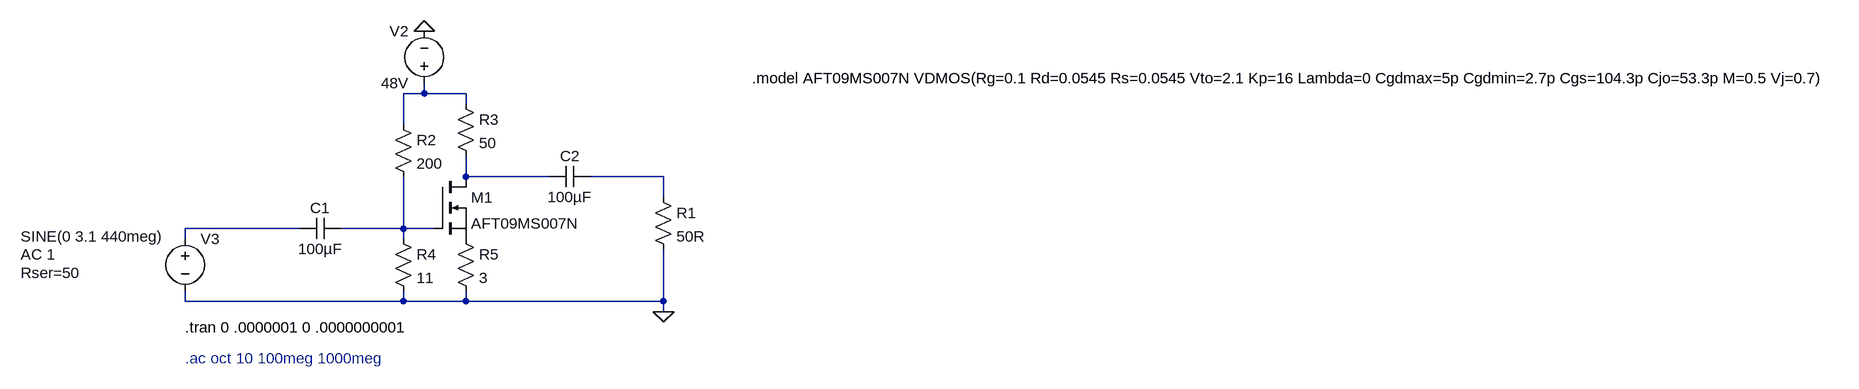
[diagram p0: schematic Draft1.asc]
Draft1.asc, the LTspice schematic file:
Version 4.1
SHEET 1 4972 680
WIRE 176 16 176 0
WIRE 176 16 144 16
WIRE 240 16 176 16
WIRE 240 32 240 16
WIRE 144 64 144 16
WIRE 240 144 240 112
WIRE 368 144 240 144
WIRE 544 144 432 144
WIRE 544 176 544 144
WIRE -16 224 -192 224
WIRE 144 224 144 144
WIRE 144 224 48 224
WIRE 192 224 144 224
WIRE -192 240 -192 224
WIRE 144 240 144 224
WIRE -192 336 -192 320
WIRE 144 336 144 320
WIRE 144 336 -192 336
WIRE 240 336 240 320
WIRE 240 336 144 336
WIRE 544 336 544 256
WIRE 544 336 240 336
WIRE 544 352 544 336
FLAG 544 352 0
FLAG 176 -80 0
SYMBOL nmos 192 144 R0
SYMATTR InstName M1
SYMATTR Value AFT09MS007N
SYMBOL voltage 176 16 R180
WINDOW 0 24 96 Left 2
WINDOW 3 24 16 Left 2
WINDOW 123 0 0 Left 0
WINDOW 39 0 0 Left 0
SYMATTR InstName V2
SYMATTR Value 48V
SYMBOL cap -16 208 M90
WINDOW 0 0 32 VBottom 2
WINDOW 3 32 32 VTop 2
SYMATTR InstName C1
SYMATTR Value 100µF
SYMBOL cap 368 160 R270
WINDOW 0 32 32 VTop 2
WINDOW 3 0 32 VBottom 2
SYMATTR InstName C2
SYMATTR Value 100µF
SYMBOL res 528 160 R0
SYMATTR InstName R1
SYMATTR Value 50R
SYMBOL voltage -192 224 R0
WINDOW 3 -253 12 Left 2
WINDOW 123 -253 40 Left 2
WINDOW 39 -253 68 Left 2
SYMATTR InstName V3
SYMATTR Value SINE(0 3.1 440meg)
SYMATTR Value2 AC 1
SYMATTR SpiceLine Rser=50
SYMBOL res 128 48 R0
SYMATTR InstName R2
SYMATTR Value 200
SYMBOL res 224 16 R0
SYMATTR InstName R3
SYMATTR Value 50
SYMBOL res 128 224 R0
SYMATTR InstName R4
SYMATTR Value 11
SYMBOL res 224 224 R0
SYMATTR InstName R5
SYMATTR Value 3
TEXT -192 376 Left 2 !.tran 0 .0000001 0 .0000000001
TEXT 680 -8 Left 2 !.model AFT09MS007N VDMOS(Rg=0.1 Rd=0.0545 Rs=0.0545 Vto=2.1 Kp=16 Lambda=0 Cgdmax=5p Cgdmin=2.7p Cgs=104.3p Cjo=53.3p M=0.5 Vj=0.7)
TEXT -192 424 Left 2 ;.ac oct 10 100meg 1000meg

The netlist it stands for:
* Draft1.asc
M1 N002 N005 P001 P001 AFT09MS007N
V2 N001 0 48V
C1 N004 N005 100µF
C2 N002 N003 100µF
R1 N003 0 50R
V3 N004 0 SINE(0 3.1 440meg) AC 1 Rser=50
R2 N001 N005 200
R3 N001 N002 50
R4 N005 0 11
R5 P001 0 3
.model NMOS NMOS
.model PMOS PMOS
.lib standard.mos
.tran 0 .0000001 0 .0000000001
.model AFT09MS007N VDMOS(Rg=0.1 Rd=0.0545 Rs=0.0545 Vto=2.1 Kp=16 Lambda=0 Cgdmax=5p Cgdmin=2.7p Cgs=104.3p Cjo=53.3p M=0.5 Vj=0.7)
* .ac oct 10 100meg 1000meg
.backanno
.end